# Altium schematic sheet headers.SchDoc
size A; SheetNumber: 4; SheetTotal: 4
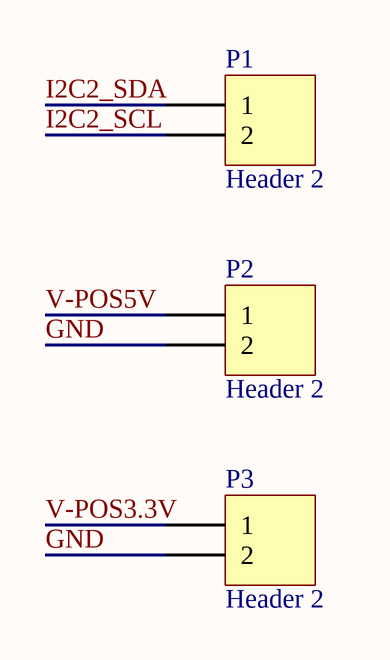
[diagram p0: headers.SchDoc]

## Parts
P1  Header 2  [Pin Header 1x2 TH Pitch 2.54mm]
P2  Header 2  [Pin Header 1x2 TH Pitch 2.54mm]
P3  Header 2  [Pin Header 1x2 TH Pitch 2.54mm]

## Nets
GND: P2.2 P3.2
I2C2_SCL: P1.2
I2C2_SDA: P1.1
V-POS3.3V: P3.1
V-POS5V: P2.1

## Library data of the parts
P1-P3 = Header 2: Header, 2-Pin; LatestRevisionDate: 17-Jul-2002; LatestRevisionNote: Re-released for DXP Platform.; Publisher: Altium Limited